# EAGLE design servoshield (EAGLE 6.5.0)
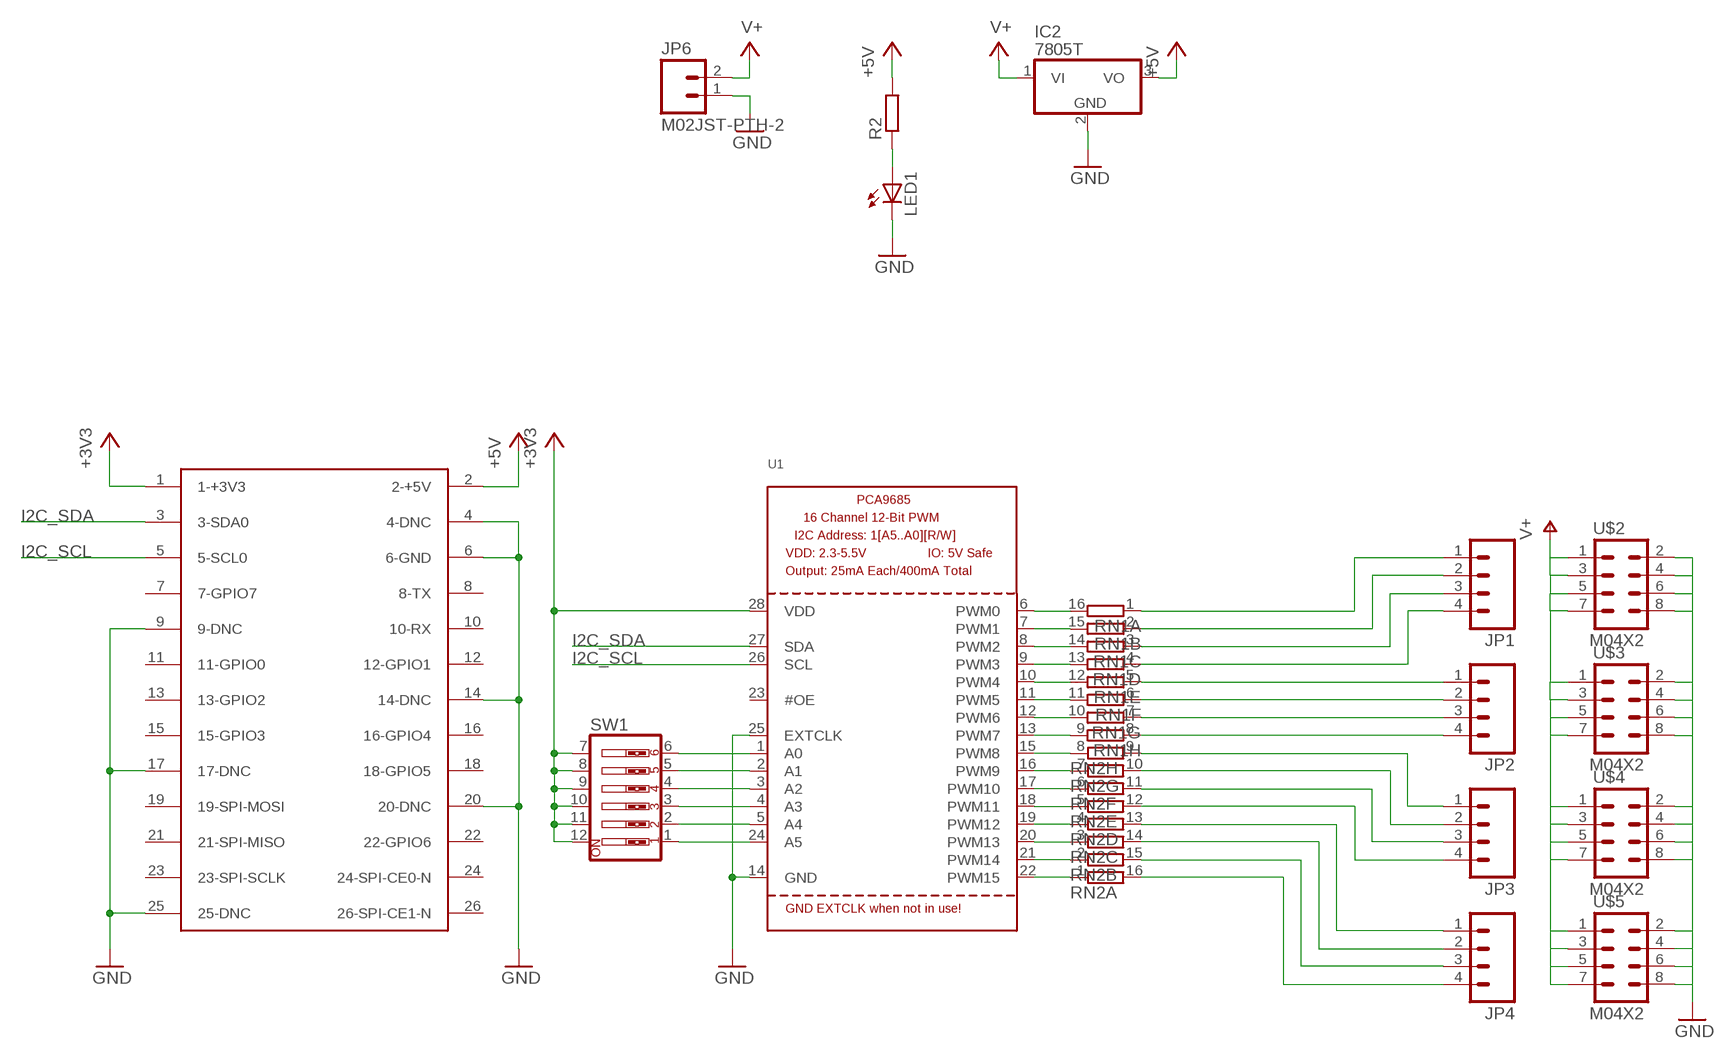
[diagram p0: schematic, sheet 1]

## Parts
IC2  7805T  [TO220H]
JP1  M04PTH  [1X04]
JP2  M04PTH  [1X04]
JP3  M04PTH  [1X04]
JP4  M04PTH  [1X04]
JP6  M02JST-PTH-2  [JST-2-PTH]
LED1  LED3MM  [LED3MM]
R2  R-EU_0207/7  [0207/7]
RN1  8R-N  [DIL16]
RN2  8R-N  [DIL16]
SW1  SW_DIP-6  [EDG-06]
U1  PCA9685  [TSSOP28]
U$1  RASPBERRY-PI  [RASPBERRY-PI]
U$2  M04X2  [2X4]
U$3  M04X2  [2X4]
U$4  M04X2  [2X4]
U$5  M04X2  [2X4]

## Nets
+3V3: SW1.7 SW1.8 SW1.9 SW1.10 SW1.11 SW1.12 U1.28(VDD) U$1.1(1-+3V3)
+5V: IC2.3(VO) R2.2 U$1.2(2-+5V)
GND: IC2.2(GND) JP6.1 LED1.K(C) U1.14(GND) U1.25(EXTCLK) U$1.4(4-DNC) U$1.6(6-GND) U$1.9(9-DNC) U$1.14(14-DNC) U$1.17(17-DNC) U$1.20(20-DNC) U$1.25(25-DNC) U$2.2 U$2.4 U$2.6 U$2.8 U$3.2 U$3.4 U$3.6 U$3.8 U$4.2 U$4.4 U$4.6 U$4.8 U$5.2 U$5.4 U$5.6 U$5.8
I2C_SCL: U1.26(SCL) U$1.5(5-SCL0)
I2C_SDA: U1.27(SDA) U$1.3(3-SDA0)
N$1: RN2.7 U1.16(PWM9)
N$2: RN2.8 U1.15(PWM8)
N$3: RN1.9 U1.13(PWM7)
N$4: RN2.1 U1.22(PWM15)
N$5: JP1.4 RN1.4
N$6: JP1.3 RN1.3
N$7: JP1.2 RN1.2
N$8: JP1.1 RN1.1
N$9: JP3.1 RN2.9
N$10: JP3.2 RN2.10
N$11: SW1.1 U1.24(A5)
N$12: SW1.2 U1.5(A4)
N$13: SW1.3 U1.4(A3)
N$14: SW1.4 U1.3(A2)
N$15: SW1.5 U1.2(A1)
N$16: SW1.6 U1.1(A0)
N$17: JP3.3 RN2.11
N$18: JP3.4 RN2.12
N$19: JP4.1 RN2.13
N$20: JP4.2 RN2.14
N$21: JP4.3 RN2.15
N$22: JP4.4 RN2.16
N$23: RN2.2 U1.21(PWM14)
N$24: RN2.3 U1.20(PWM13)
N$25: RN2.4 U1.19(PWM12)
N$26: RN2.5 U1.18(PWM11)
N$27: RN2.6 U1.17(PWM10)
N$28: RN1.10 U1.12(PWM6)
N$29: RN1.11 U1.11(PWM5)
N$30: RN1.12 U1.10(PWM4)
N$31: RN1.13 U1.9(PWM3)
N$32: RN1.14 U1.8(PWM2)
N$33: RN1.15 U1.7(PWM1)
N$34: RN1.16 U1.6(PWM0)
N$35: JP2.1 RN1.5
N$36: JP2.4 RN1.8
N$37: JP2.3 RN1.7
N$38: JP2.2 RN1.6
N$39: LED1.A R2.1
V+: IC2.1(VI) JP6.2 U$2.1 U$2.3 U$2.5 U$2.7 U$3.1 U$3.3 U$3.5 U$3.7 U$4.1 U$4.3 U$4.5 U$4.7 U$5.1 U$5.3 U$5.5 U$5.7
Unconnected: U1.23(#OE) U$1.7(7-GPIO7) U$1.8(8-TX) U$1.10(10-RX) U$1.11(11-GPIO0) U$1.12(12-GPIO1) U$1.13(13-GPIO2) U$1.15(15-GPIO3) U$1.16(16-GPIO4) U$1.18(18-GPIO5) U$1.19(19-SPI-MOSI) U$1.21(21-SPI-MISO) U$1.22(22-GPIO6) U$1.23(23-SPI-SCLK) U$1.24(24-SPI-CE0-N) U$1.26(26-SPI-CE1-N)

## Library data of the parts
IC2 = linear:78*: Positive VOLTAGE REGULATOR Source: http://cache.national.com/ds/LM/LM78L05.pdf http://www.fairchildsemi.com/ds/LM/LM7805.pdf
JP1-JP4 = SparkFun-Connectors:M04: Header 4 Standard 4-pin 0.1" header. Use with straight break away headers (SKU : PRT-00116), right angle break away headers (PRT-00553), swiss pins (PRT-00743), machine pins (PRT-00117), and female headers (PRT-00115). Molex polarized connector foot print use with SKU : PRT-08231 with associated crimp pins and housings. 1MM SMD Version SKU: PRT-10208
JP6 = SparkFun-Connectors:M02: Standard 2-pin 0.1" header. Use with - straight break away headers ( PRT-00116) - right angle break away headers (PRT-00553) - swiss pins (PRT-00743) - machine pins (PRT-00117) - female headers (PRT-00115) Molex polarized connector foot print use with: PRT-08233 with associated crimp pins and housings. 2.54_SCREWTERM for use with PRT-10571. 3.5mm Screw Terminal footprints for PRT-08084 5mm Screw Terminal footprints for use with PRT-08433; SKU: PRT-09914
LED1 = adafruit:LED: LED OSRAM: - CHIPLED LG R971, LG N971, LY N971, LG Q971, LY Q971, LO R971, LY R971 LH N974, LH R974 LS Q976, LO Q976, LY Q976 LO Q996 - Hyper CHIPLED LW Q18S LB Q993, LB Q99A, LB R99A - SideLED LS A670, LO A670, LY A670, LG A670, LP A670 LB A673, LV A673, LT A673, LW A673 LH A674 LY A675 LS A676, LA A676, LO A676, LY A676, LW A676 LS A679, LY A679, LG A679 - Hyper Micro SIDELED® LS Y876, LA Y876, LO Y876, LY Y876 LT Y87S - SmartLED LW L88C, LW L88S LB L89C, LB L89S, LG L890 LS L89K, LO L89K, LY L89K LS L896, LA L896, LO L896, LY L896 - TOPLED LS T670, LO T670, LY T670, LG T670, LP T670 LSG T670, LSP T670, LSY T670, LOP T670, LYG T670 LG T671, LOG T671, LSG T671 LB T673, LV T673, LT T673, LW T673 LH T674 LS T676, LA T676, LO T676, LY T676, LB T676, LH T676, LSB T676, LW T676 LB T67C, LV T67C, LT T67C, LS T67K, LO T67K, LY T67K, LW E67C LS E67B, LA E67B, LO E67B, LY E67B, LB E67C, LV E67C, LT E67C LW T67C LS T679, LY T679, LG T679 LS T770, LO T770, LY T770, LG T770, LP T770 LB T773, LV T773, LT T773, LW T773 LH T774 LS E675, LA E675, LY E675, LS T675 LS T776, LA T776, LO T776, LY T776, LB T776 LHGB T686 LT T68C, LB T68C - Hyper Mini TOPLED® LB M676 - Mini TOPLED Santana® LG M470 LS M47K, LO M47K, LY M47K Source: http://www.osram.convergy.de/
R2 = rcl:R-EU_: RESISTOR, European symbol
RN1 RN2 = resistor-dil:8R-N: DIL RESISTOR; OC_FARNELL: unknown; OC_NEWARK: unknown
SW1 = special:SW_DIP-6: DIP SWITCH
U1 = adafruit:PCA9685: PCA9685 - 16 Channel 12-Bit I2C PWM Controller 5.0V tolerant 16 channel, 12-bit I2C PWM controller with 25mA per output (max. 400mA total) Digikey: 568-5931-1-ND
U$1 = RaspberryPi:RASPBERRY-PI: Raspberry Pi Board <http://www.raspberrypi.org/> Jacques Lagnel V1.0 (beta) 2012 Board dimension: Forum 3D model <http://www.raspberrypi.org/forum/general-discussion/mechanical-profile-3d-models?value=3d%20model&type=1&include=1&search=1&ret=all> The GPIO Connector (P1): http://elinux.org/RPi_Low-level_peripherals
U$2-U$5 = SparkFun-Connectors:M04X2: .1" header, two rows of four.

## Board
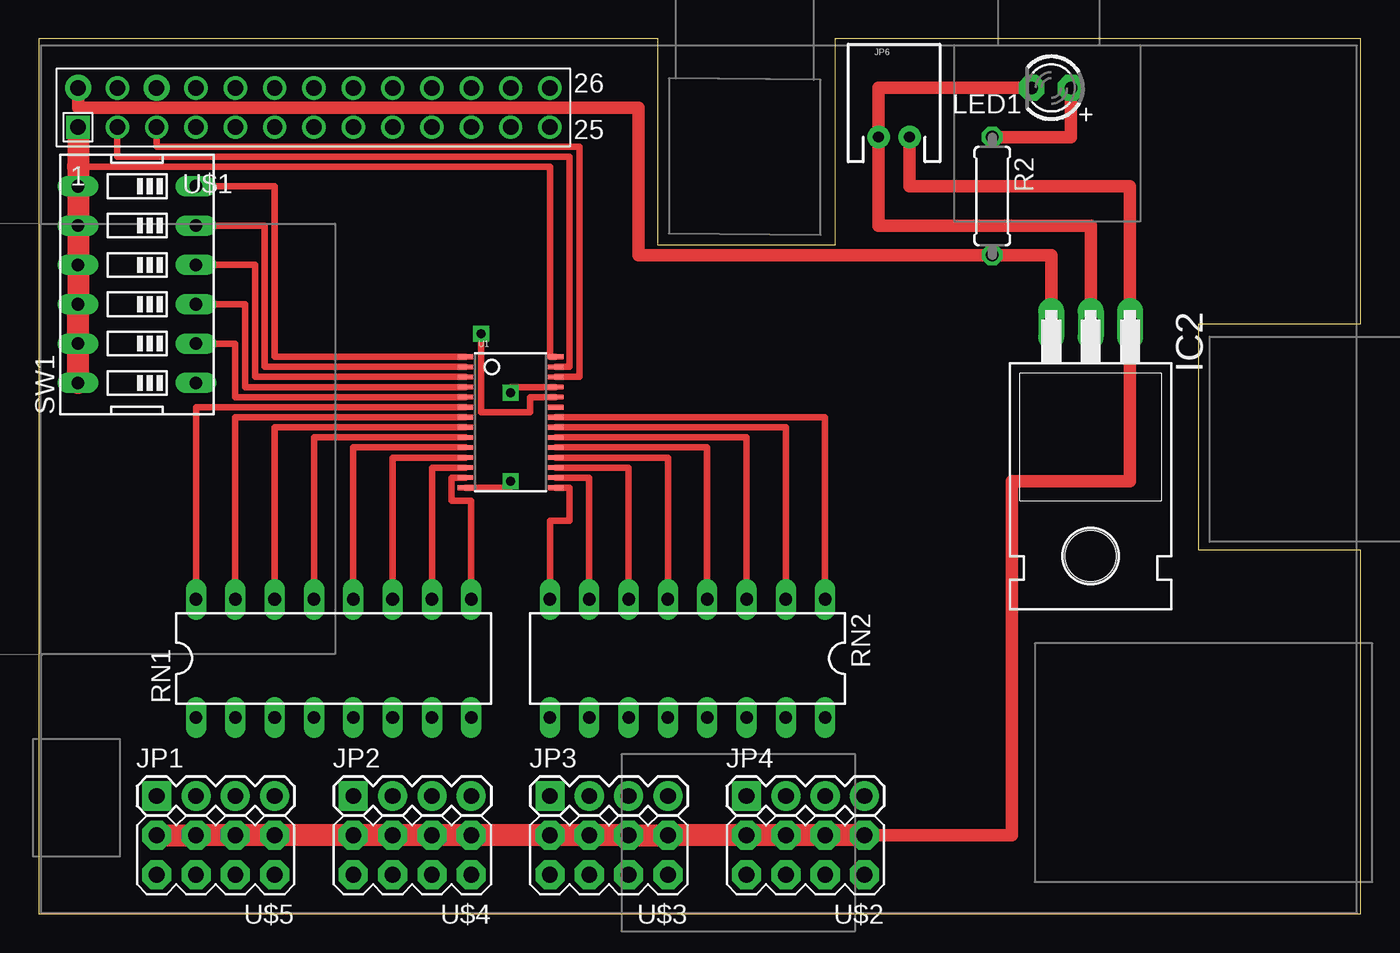
[diagram p1: board, top side]
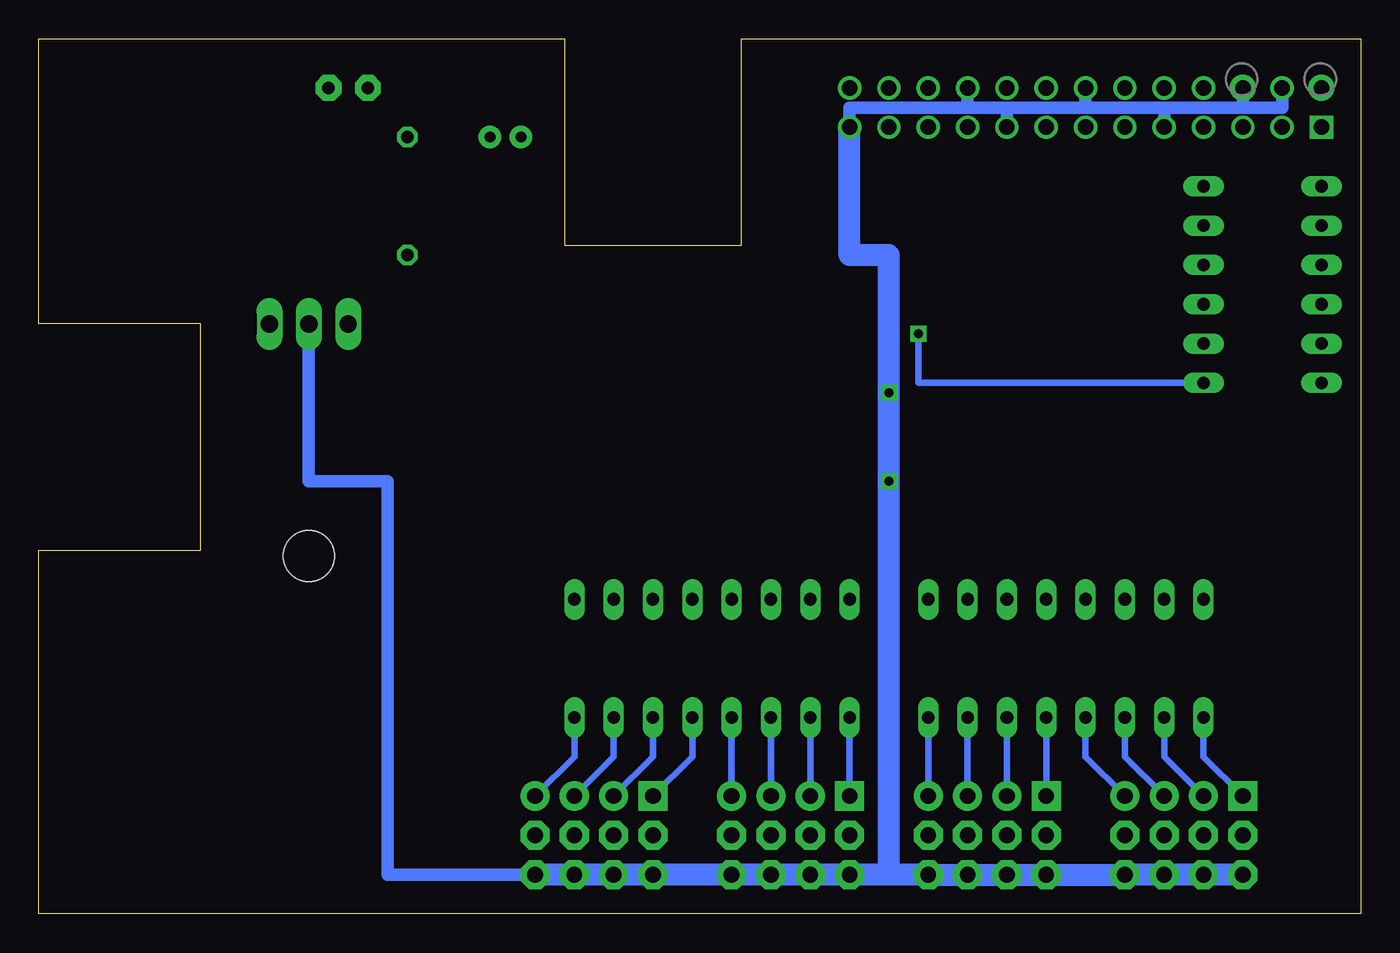
[diagram p2: board, bottom side, seen from below]

Size 85.39 x 56.52 mm. Coordinates in mm from the lower left corner, seen from the top.
Outline: 0,0 85.39,0 85.39,23.5 74.93,23.5 74.93,38.1 85.39,38.1 85.39,56.51 51.44,56.52 51.44,43.18 40.01,43.18 40.01,56.51 0,56.51 0,0
Copper layers (1*16): Top 0.035mm / dielectric 1.5mm / Bottom 0.035mm
Design rules "default": minimum track width 10mil, minimum drill 24mil, track to track 8mil, track to pad 8mil, pad to pad 8mil, via to via 8mil, smd to smd 8mil, copper to edge 40mil, drill to drill 8mil, minimum pad ring 10mil, minimum via ring 8mil, stop-mask expansion 4mil, vias tented up to drill 0mil, thermal gap 10mil

### Footprints (pad centres in the part's own frame; a part is rotated, then mirrored left to right if it is on the bottom)
TO220H = drill 1.118 long: 1 -2.54,-10.16; 2 0,-10.16; 3 2.54,-10.16 | hole 3.302: 0,4.826
1X04 = drill 1.016 pad 1.88 square: 1 0,0 | drill 1.016 pad 1.88: 2 2.54,0; 3 5.08,0; 4 7.62,0
JST-2-PTH = drill 0.7 pad 1.448: 1 -1,0; 2 1,0
LED3MM = drill 0.813 pad 1.676 octagon: A -1.27,0; K 1.27,0
0207/7 = drill 0.813 octagon: 1 -3.81,0; 2 3.81,0
DIL16 = drill 0.813 long: 1 -8.89,-3.81; 2 -6.35,-3.81; 3 -3.81,-3.81; 4 -1.27,-3.81; 5 1.27,-3.81; 6 3.81,-3.81; 7 6.35,-3.81; 8 8.89,-3.81; 9 8.89,3.81; 10 6.35,3.81; 11 3.81,3.81; 12 1.27,3.81; 13 -1.27,3.81; 14 -3.81,3.81; 15 -6.35,3.81; 16 -8.89,3.81
EDG-06 = drill 0.813 long: 1 -6.35,-3.81; 2 -3.81,-3.81; 3 -1.27,-3.81; 4 1.27,-3.81; 5 3.81,-3.81; 6 6.35,-3.81; 7 6.35,3.81; 8 3.81,3.81; 9 1.27,3.81; 10 -1.27,3.81; 11 -3.81,3.81; 12 -6.35,3.81
TSSOP28 = smd 0.305 x 0.991: 1 -4.225,-2.918; 2 -3.575,-2.918; 3 -2.925,-2.918; 4 -2.275,-2.918; 5 -1.625,-2.918; 6 -0.975,-2.918; 7 -0.325,-2.918; 8 0.325,-2.918; 9 0.975,-2.918; 10 1.625,-2.918; 11 2.275,-2.918; 12 2.925,-2.918; 13 3.575,-2.918; 14 4.225,-2.918; 15 4.225,2.918; 16 3.575,2.918; 17 2.925,2.918; 18 2.275,2.918; 19 1.625,2.918; 20 0.975,2.918; 21 0.325,2.918; 22 -0.325,2.918; 23 -0.975,2.918; 24 -1.625,2.918; 25 -2.275,2.918; 26 -2.925,2.918; 27 -3.575,2.918; 28 -4.225,2.918
RASPBERRY-PI = drill 1 square: 1 0,0 | drill 1 pad 1.676: 2 0,2.54; 6 5.08,2.54 | drill 1: 3 2.54,0; 4 2.54,2.54; 5 5.08,0; 7 7.62,0; 8 7.62,2.54; 9 10.16,0; 10 10.16,2.54; 11 12.7,0; 12 12.7,2.54; 13 15.24,0; 14 15.24,2.54; 15 17.78,0; 16 17.78,2.54; 17 20.32,0; 18 20.32,2.54; 19 22.86,0; 20 22.86,2.54; 21 25.4,0; 22 25.4,2.54; 23 27.94,0; 24 27.94,2.54; 25 30.48,0; 26 30.48,2.54
2X4 = drill 1.016 pad 1.88 octagon: 1 -3.81,-1.27; 2 -3.81,1.27; 3 -1.27,-1.27; 4 -1.27,1.27; 5 1.27,-1.27; 6 1.27,1.27; 7 3.81,-1.27; 8 3.81,1.27

### Placement (x,y rotation side)
IC2  67.94,27.94 180 top
JP1  7.62,7.62 0 top
JP2  20.32,7.62 0 top
JP3  33.02,7.62 0 top
JP4  45.72,7.62 0 top
JP6  55.24,50.16 0 top
LED1  65.41,53.34 180 top
R2  61.59,46.35 270 top
RN1  19.05,16.51 0 top
RN2  41.91,16.51 180 top
SW1  6.35,40.64 90 top
U1  30.48,31.75 270 top
U$1  2.54,50.8 0 top
U$2  49.53,3.81 180 top
U$3  36.83,3.81 180 top
U$4  24.13,3.81 180 top
U$5  11.43,3.81 180 top

### Tracks (layer width: path | path; a pad name or v marks a point on that pad's centre or on a via)
+3V3
  Top 0.406: U1.28 33.02,35.98 33.02,48.26 2.54,48.26
  Top 1.422: U$1.1 2.54,48.26 SW1.7 SW1.8 SW1.9 SW1.10 SW1.11 SW1.12
+5V
  Top 0.813: U$1.2 2.54,52.07 38.73,52.07 38.73,42.55 R2.2 65.41,42.55 IC2.3
GND  (via drill 0.6)
  Top 0.406: 31.75,34.02 U1.25 30.48,34.02 v30.48,33.66 | U1.14 30.48,27.52 v30.48,27.94
  Top 0.813: IC2.2 67.94,44.45 54.24,44.45 JP6.1 54.24,53.34 LED1.K
  Bottom 0.813: U$1.25 33.02,52.07 25.4,52.07 | 25.4,52.07 22.86,52.07 | 22.86,52.07 17.78,52.07 | 17.78,52.07 U$1.14 | U$1.17 22.86,52.07 | U$1.20 25.4,52.07 | 17.78,52.07 12.7,52.07 | U$1.9 12.7,52.07 | 12.7,52.07 7.62,52.07 | 7.62,52.07 U$1.6 | U$1.4 5.08,52.07 7.62,52.07 | IC2.2 67.94,27.94 62.87,27.94 62.87,2.54 U$2.2
  Bottom 1.422: U$5.8 U$5.6 U$5.4 U$5.2 U$4.8 U$4.6 U$4.4 U$4.2 30.48,2.54 | 30.48,2.54 v30.48,27.94 v30.48,33.66 30.48,42.55 33.02,42.55 U$1.25 | 30.48,2.54 U$3.8 U$3.6 U$3.4 U$3.2 U$2.8 U$2.6 U$2.4 U$2.2
  other vias: 67.94,38.1
I2C_SCL
  Top 0.406: U1.26 34.92,34.67 34.92,49.53 7.62,49.53 U$1.5
I2C_SDA
  Top 0.406: U1.27 34.29,35.33 34.29,48.9 5.08,48.9 U$1.3
N$1
  Top 0.406: U1.16 35.56,28.18 RN2.7
N$2
  Top 0.406: U1.15 34.29,27.52 34.29,25.4 33.02,25.4 RN2.8
N$3
  Top 0.406: U1.13 26.67,28.18 26.67,26.67 27.94,26.67 RN1.9
N$4
  Top 0.406: U1.22 50.8,32.08 RN2.1
N$5
  Bottom 0.406: RN1.4 17.78,10.16 JP1.4
N$6
  Bottom 0.406: RN1.3 15.24,10.16 JP1.3
N$7
  Bottom 0.406: RN1.2 12.7,10.16 JP1.2
N$8
  Bottom 0.406: RN1.1 10.16,10.16 JP1.1
N$9
  Bottom 0.406: JP3.1 RN2.9
N$10
  Bottom 0.406: RN2.10 JP3.2
N$11  (via drill 0.6)
  Top 0.406: U1.24 31.75,33.38 31.75,32.38 28.57,32.38 v28.57,37.47
  Bottom 0.406: SW1.1 28.57,34.29 v28.57,37.47
N$12
  Top 0.406: U1.5 12.7,33.38 12.7,36.83 SW1.2
N$13
  Top 0.406: U1.4 13.34,34.02 13.34,39.37 SW1.3
N$14
  Top 0.406: U1.3 13.97,34.67 13.97,41.91 SW1.4
N$15
  Top 0.406: U1.2 14.61,35.33 14.61,44.45 SW1.5
N$16
  Top 0.406: U1.1 15.24,35.98 15.24,46.99 SW1.6
N$17
  Bottom 0.406: RN2.11 JP3.3
N$18
  Bottom 0.406: RN2.12 JP3.4
N$19
  Bottom 0.406: RN2.13 43.18,10.16 JP4.1
N$20
  Bottom 0.406: RN2.14 45.72,10.16 JP4.2
N$21
  Bottom 0.406: RN2.15 48.26,10.16 JP4.3
N$22
  Bottom 0.406: RN2.16 50.8,10.16 JP4.4
N$23
  Top 0.406: U1.21 48.26,31.43 RN2.2
N$24
  Top 0.406: U1.20 45.72,30.77 RN2.3
N$25
  Top 0.406: U1.19 43.18,30.12 RN2.4
N$26
  Top 0.406: U1.18 40.64,29.48 RN2.5
N$27
  Top 0.406: U1.17 38.1,28.82 RN2.6
N$28
  Top 0.406: U1.12 25.4,28.82 RN1.10
N$29
  Top 0.406: U1.11 22.86,29.48 RN1.11
N$30
  Top 0.406: U1.10 20.32,30.12 RN1.12
N$31
  Top 0.406: U1.9 17.78,30.77 RN1.13
N$32
  Top 0.406: U1.8 15.24,31.43 RN1.14
N$33
  Top 0.406: U1.7 12.7,32.08 RN1.15
N$34
  Top 0.406: U1.6 10.16,32.73 RN1.16
N$35
  Bottom 0.406: RN1.5 JP2.1
N$36
  Bottom 0.406: RN1.8 JP2.4
N$37
  Bottom 0.406: RN1.7 JP2.3
N$38
  Bottom 0.406: RN1.6 JP2.2
N$39
  Top 0.813: R2.1 66.67,50.16 LED1.A
V+
  Top 0.813: JP6.2 56.24,46.99 70.48,46.99 IC2.1 70.48,27.94 62.87,27.94 62.87,5.08 U$2.1
  Top 1.422: U$2.1 U$2.3 U$2.5 U$2.7 U$3.1 U$3.3 U$3.5 U$3.7 U$4.1 U$4.3 U$4.5 U$4.7 U$5.1 U$5.3 U$5.5 U$5.7